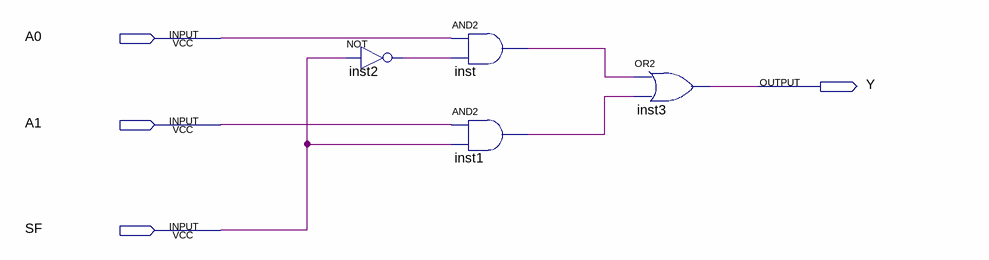
[diagram p0: schematic sheet]
// Quartus schematic my_mux_2_1.bdf as structural Verilog: 4 symbols, 4 pins
module my_mux_2_1 (
  input  A0,
  input  A1,
  input  SF,
  output Y
);

  wire inst1_out, inst2_out, inst_out;

  not inst2 (inst2_out, SF);
  and inst (inst_out, A0, inst2_out);
  and inst1 (inst1_out, A1, SF);
  or inst3 (Y, inst_out, inst1_out);
endmodule
